# EAGLE schematic basic_schematic (EAGLE 6.4)
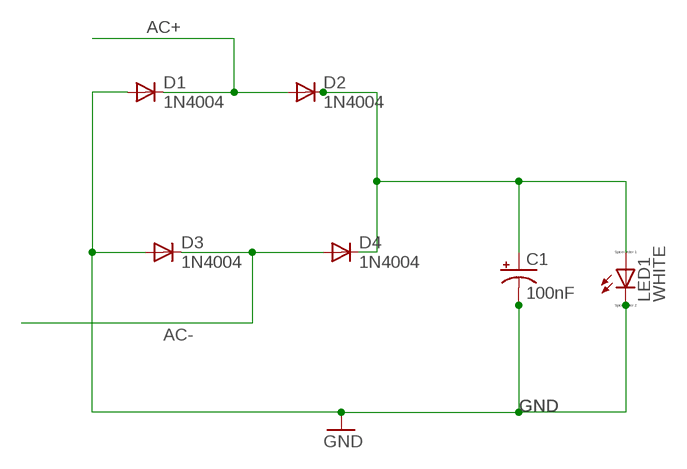
[diagram p0: schematic, sheet 1]

## Parts
C1  100nF  CPOL-US153CLV-1014  [153CLV-1014]
D1  1N4004  [DO41-10]
D2  1N4004  [DO41-10]
D3  1N4004  [DO41-10]
D4  1N4004  [DO41-10]
LED1  WHITE  LED_E  [LED_1206]

## Nets
AC+: D1.C D2.A
AC-: D3.C D4.A
GND: C1.- D1.A D3.A LED1.C
N$2: C1.+ D2.C D4.C LED1.A

## Library data of the parts
C1 = resistor:CPOL-US: POLARIZED CAPACITOR, American symbol
D1-D4 = diode:1N4004: DIODE general purpose rectifier, 1 A
LED1 = eagle-ltspice:LED_E: LED Source: http://www.osram.convergy.de Source: www.luxeon.com Source: www.kingbright.com; SPICEMODEL: NONE; SPICEPREFIX: D; SPICETYPE: diode